# EAGLE design placa_eagle_1 (EAGLE 9.1.3)
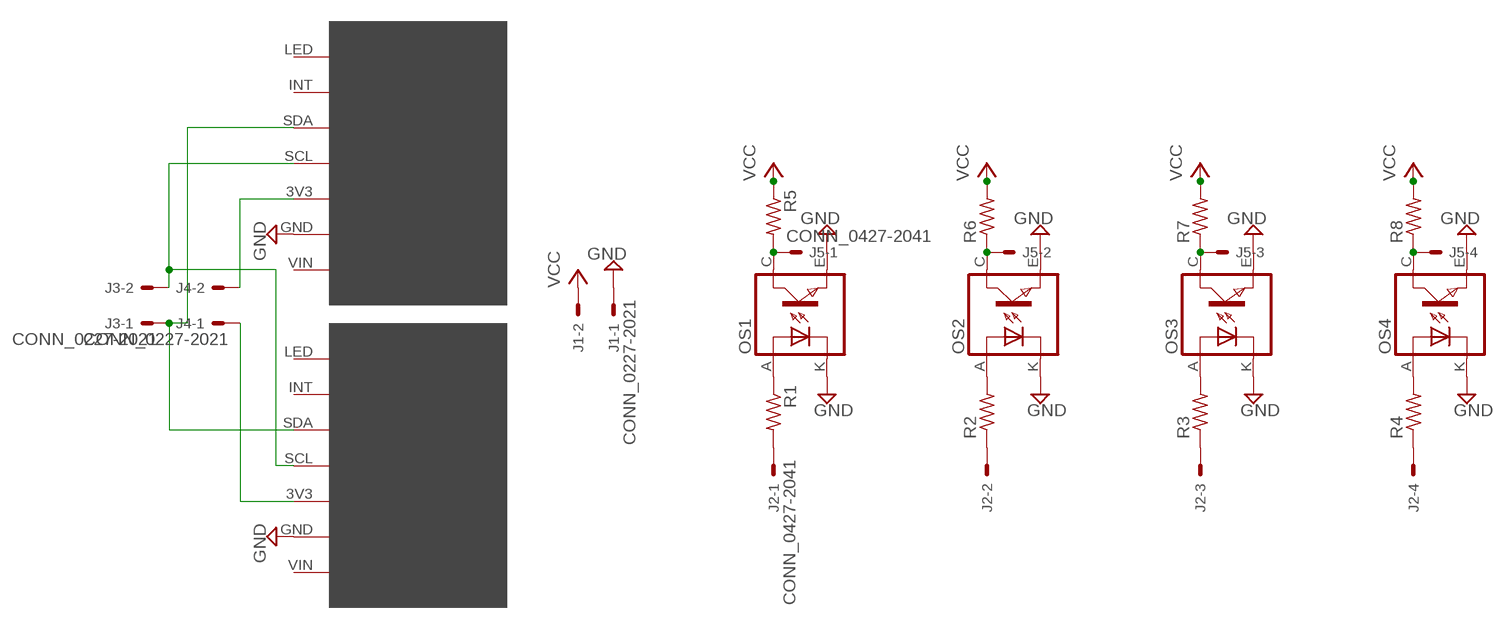
[diagram p0: schematic, sheet 1]

## Parts
J1  CONN_0227-2021  [6410-02]
J2  CONN_0427-2041  [6410-04]
J3  CONN_0227-2021  [6410-02]
J4  CONN_0227-2021  [6410-02]
J5  CONN_0427-2041  [6410-04]
OS1  TCRT5000  [TCRT5000]
OS2  TCRT5000  [TCRT5000]
OS3  TCRT5000  [TCRT5000]
OS4  TCRT5000  [TCRT5000]
R1  R-US_0204/7  [0204/7]
R2  R-US_0204/7  [0204/7]
R3  R-US_0204/7  [0204/7]
R4  R-US_0204/7  [0204/7]
R5  R-US_0204/7  [0204/7]
R6  R-US_0204/7  [0204/7]
R7  R-US_0204/7  [0204/7]
R8  R-US_0204/7  [0204/7]
TCS1  TCS34725  [TCS34725]
TCS2  TCS34725  [TCS34725]

## Nets
GND: J1.1 OS1.E(EMITTER) OS1.K(CATHODE) OS2.E(EMITTER) OS2.K(CATHODE) OS3.E(EMITTER) OS3.K(CATHODE) OS4.E(EMITTER) OS4.K(CATHODE) TCS1.GND TCS2.GND
N$1: OS1.A(ANODE) R1.1
N$2: OS2.A(ANODE) R2.2
N$3: OS3.A(ANODE) R3.2
N$4: OS4.A(ANODE) R4.2
N$5: J5.1 OS1.C(COLLECTOR) R5.2
N$6: J5.2 OS2.C(COLLECTOR) R6.1
N$7: J5.3 OS3.C(COLLECTOR) R7.1
N$8: J5.4 OS4.C(COLLECTOR) R8.1
N$9: J2.1 R1.2
N$10: J2.2 R2.1
N$11: J2.3 R3.1
N$12: J2.4 R4.1
N$13: J4.2 TCS1.3V3
N$14: J4.1 TCS2.3V3
N$16: J3.1 TCS1.SDA TCS2.SDA
N$18: J3.2 TCS1.SCL TCS2.SCL
VCC: J1.2 R5.1 R6.2 R7.2 R8.2
Unconnected: TCS1.INT TCS1.LED TCS1.VIN TCS2.INT TCS2.LED TCS2.VIN

## Library data of the parts
J1 J3 J4 = Robotica-IFRN-SC-conectores:CONN_02: CONNECTOR wire to board 2.54 mm (.1 inch) pitch header; OC_FARNELL: unknown; OC_NEWARK: unknown
J2 J5 = Robotica-IFRN-SC-conectores:CONN_04: CONNECTOR wire to board 2.54 mm (.1 inch) pitch header; OC_FARNELL: unknown; OC_NEWARK: unknown
OS1-OS4 = Robotica-IFRN-SC-sensores:TCRT5000
R1-R8 = rcl:R-US_: RESISTOR, American symbol
TCS1 TCS2 = Robotica-IFRN-SC-sensores:TCS34725: Sensor de cor TCS34725

## Board
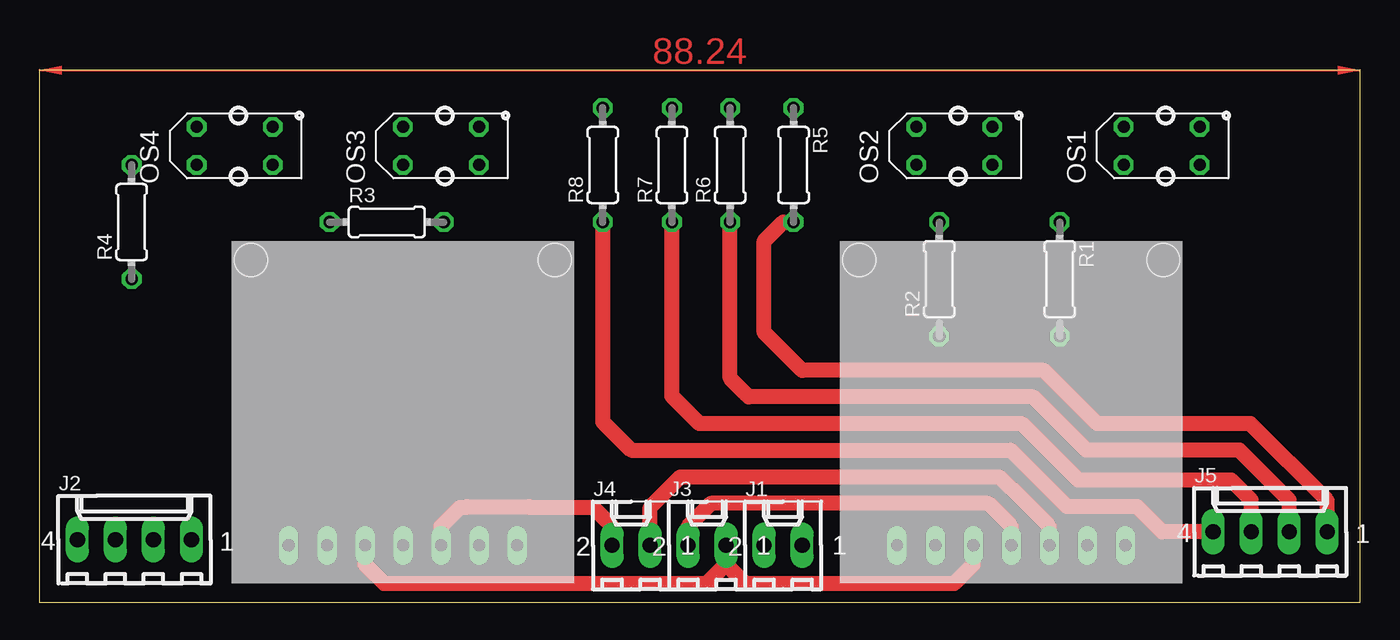
[diagram p1: board, top side]
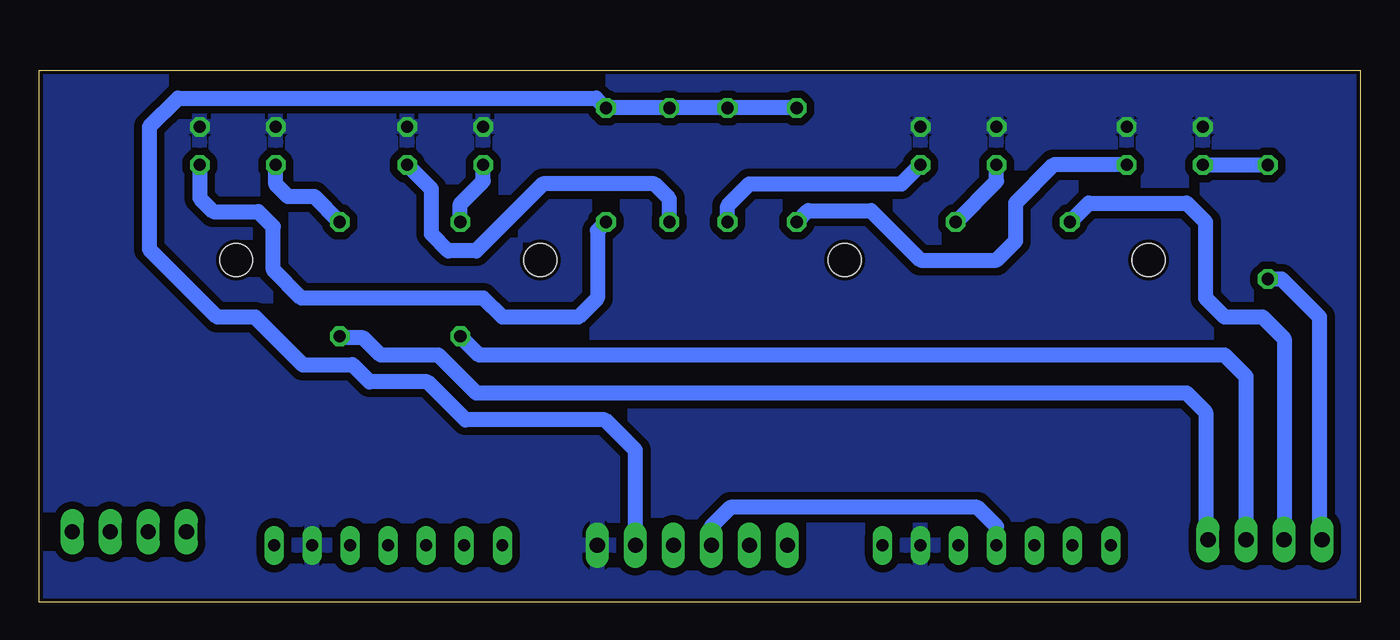
[diagram p2: board, bottom side, seen from below]

Size 88.24 x 35.55 mm. Coordinates in mm from the lower left corner, seen from the top.
Outline: 0,0 88.24,0 88.24,35.55 0,35.55 0,0
Copper layers (1*16): Top 0.035mm / dielectric 1.5mm / Bottom 0.035mm
Design rules "default *": minimum track width 40mil, minimum drill 0.35mm, track to track 20mil, track to pad 20mil, pad to pad 20mil, via to via 20mil, smd to smd 6mil, copper to edge 10mil, drill to drill 6mil, minimum pad ring 10mil, minimum via ring 8mil, stop-mask expansion 4mil, vias tented up to drill 0mil, thermal gap 10mil

### Footprints (pad centres in the part's own frame; a part is rotated, then mirrored left to right if it is on the bottom)
6410-02 = drill 1.016 long: 1 1.27,0; 2 -1.27,0
6410-04 = drill 1.016 long: 1 3.81,0; 2 1.27,0; 3 -1.27,0; 4 -3.81,0
TCRT5000 = drill 0.8 octagon: A -2.54,-1.27; C 2.54,-1.27; E 2.54,1.27; K -2.54,1.27
0204/7 = drill 0.813 octagon: 1 -3.81,0; 2 3.81,0
TCS34725 = drill 0.8 long: 3V3 0,-5.08; GND 2.54,-5.08; INT -7.62,-5.08; LED -10.16,-5.08; SCL -2.54,-5.08; SDA -5.08,-5.08; VIN 5.08,-5.08 | hole 2.2: -12.7,13.97; 7.62,13.97

### Placement (x,y rotation side)
J1  49.69,3.81 0 top
J2  6.35,4.19 0 top
J3  44.61,3.81 0 top
J4  39.53,3.81 0 top
J5  82.23,4.71 0 top
OS1  74.98,30.48 0 top
OS2  61.12,30.48 0 top
OS3  26.83,30.48 0 top
OS4  13.05,30.48 0 top
R1  68.17,21.59 270 top
R2  60.12,21.59 90 top
R3  23.21,25.4 0 top
R4  6.16,25.4 90 top
R5  50.39,29.21 270 top
R6  46.15,29.21 90 top
R7  42.26,29.21 90 top
R8  37.64,29.21 90 top
TCS1  26.83,8.89 0 top
TCS2  67.47,8.89 0 top

### Tracks (layer width: path | path; a pad name or v marks a point on that pad's centre or on a via)
GND
  pour Bottom: 0.16,35.56 87.79,35.56 87.79,0 0.16,0
N$1
  Bottom 1.016: R1.1 69.86,27.09 71.62,27.09 72.44,27.91 OS1.A
N$2
  Bottom 1.016: R2.2 60.12,26.59 58.58,28.13 OS2.A
N$3
  Bottom 1.016: R3.2 24.29,28.13 OS3.A
N$4
  Bottom 1.016: OS4.A R4.2
N$5
  Top 1.016: J5.1 86.04,6.8 80.91,11.94 70.67,11.94 67.11,15.49 50.96,15.49 48.42,18.03 48.42,24.13 49.69,25.4 R5.2
  Bottom 1.016: R5.2 50.96,24.83 50.96,20.32 52.23,19.05 57.31,19.05 58.58,20.32 70.74,20.32 72.62,22.2 72.62,25.09 73.62,26.09 76.62,26.09 77.52,26.99 OS1.C
N$6
  Top 1.016: J5.2 83.5,6.83 80.17,10.16 69.93,10.16 66.38,13.72 47.4,13.72 47.15,13.97 46.15,14.97 R6.1
  Bottom 1.016: R6.1 46.15,26.94 47.15,27.94 54.59,27.94 59.06,23.47 60.92,23.47 62.05,24.6 62.05,27.6 OS2.C
N$7
  Top 1.016: J5.3 80.96,6.83 79.62,8.17 69.41,8.17 65.64,11.94 44.1,11.94 42.26,13.78 R7.1
  Bottom 1.016: OS3.C 30.64,27.94 40.8,27.94 42.26,26.48 R7.1
N$8
  Top 1.016: J5.4 75.03,4.71 73.35,6.39 68.68,6.39 64.9,10.16 39.53,10.16 37.64,12.05 R8.1
  Bottom 1.016: R8.1 36.88,26.16 32.67,26.16 29.37,22.86 24.29,22.86 23.02,24.13 23.02,26.67 20.48,29.21 OS4.C
N$9
  Bottom 1.016: 10.32,4.03 10.32,12.7 11.59,13.97 59.04,13.97 61.58,16.51 65.44,16.51 66.6,17.67 68.06,17.67 R1.2 | 10.32,3.81 10.32,4.03 | 10.32,4.03 J2.1
N$10
  Bottom 1.016: R2.1 58.85,16.51 9.05,16.51 7.62,15.08 J2.2 7.78,4.35
N$11
  Bottom 1.016: 5.24,4.35 J2.3 5.08,17.62 6.51,19.05 9.05,19.05 10.32,20.32 10.32,25.4 11.59,26.67 18.13,26.67 R3.1
N$12
  Bottom 1.016: J2.4 2.7,4.35 2.7,19.05 3.97,20.32 5.24,21.59 R4.1
N$13
  Top 1.016: TCS1.3V3 26.83,5.08 28.1,6.35 28.54,6.35 28.57,6.39 32.71,6.39 32.74,6.35 36.99,6.35 38.26,5.08 J4.2
N$14
  Top 1.016: J4.1 40.8,6.35 42.83,8.38 64.14,8.38 64.9,7.62 64.93,7.62 67.47,5.08 TCS2.3V3
N$16
  Top 1.016: TCS1.SDA 21.75,2.54 23.02,1.27 44.61,1.27 45.88,2.54 | J3.1 45.88,2.54 | 45.88,2.54 47.15,1.27 61.12,1.27 62.39,2.54 TCS2.SDA
N$18
  Top 1.016: TCS2.SCL 64.93,5.08 63.41,6.6 44.86,6.6 43.34,5.08 J3.2
  Bottom 1.016: TCS1.SCL 24.29,5.08 25.56,6.35 42.07,6.35 43.34,5.08 J3.2
VCC
  Bottom 1.016: R8.2 R7.2 R6.2 R5.1 51.04,33.67 78.98,33.67 80.9,31.75 80.9,23.59 76.36,19.05 73.82,19.05 70.62,15.85 67.37,15.85 | J1.2 48.42,10.16 50.45,12.19 59.78,12.19 62.32,14.73 66.18,14.73 67.29,15.85 67.37,15.85 | 67.33,15.89 67.37,15.85
(copper drawn outside any net)
  shapes: Top area x1